# Altium schematic sheet PANUmbRev2.SchDoc
size C
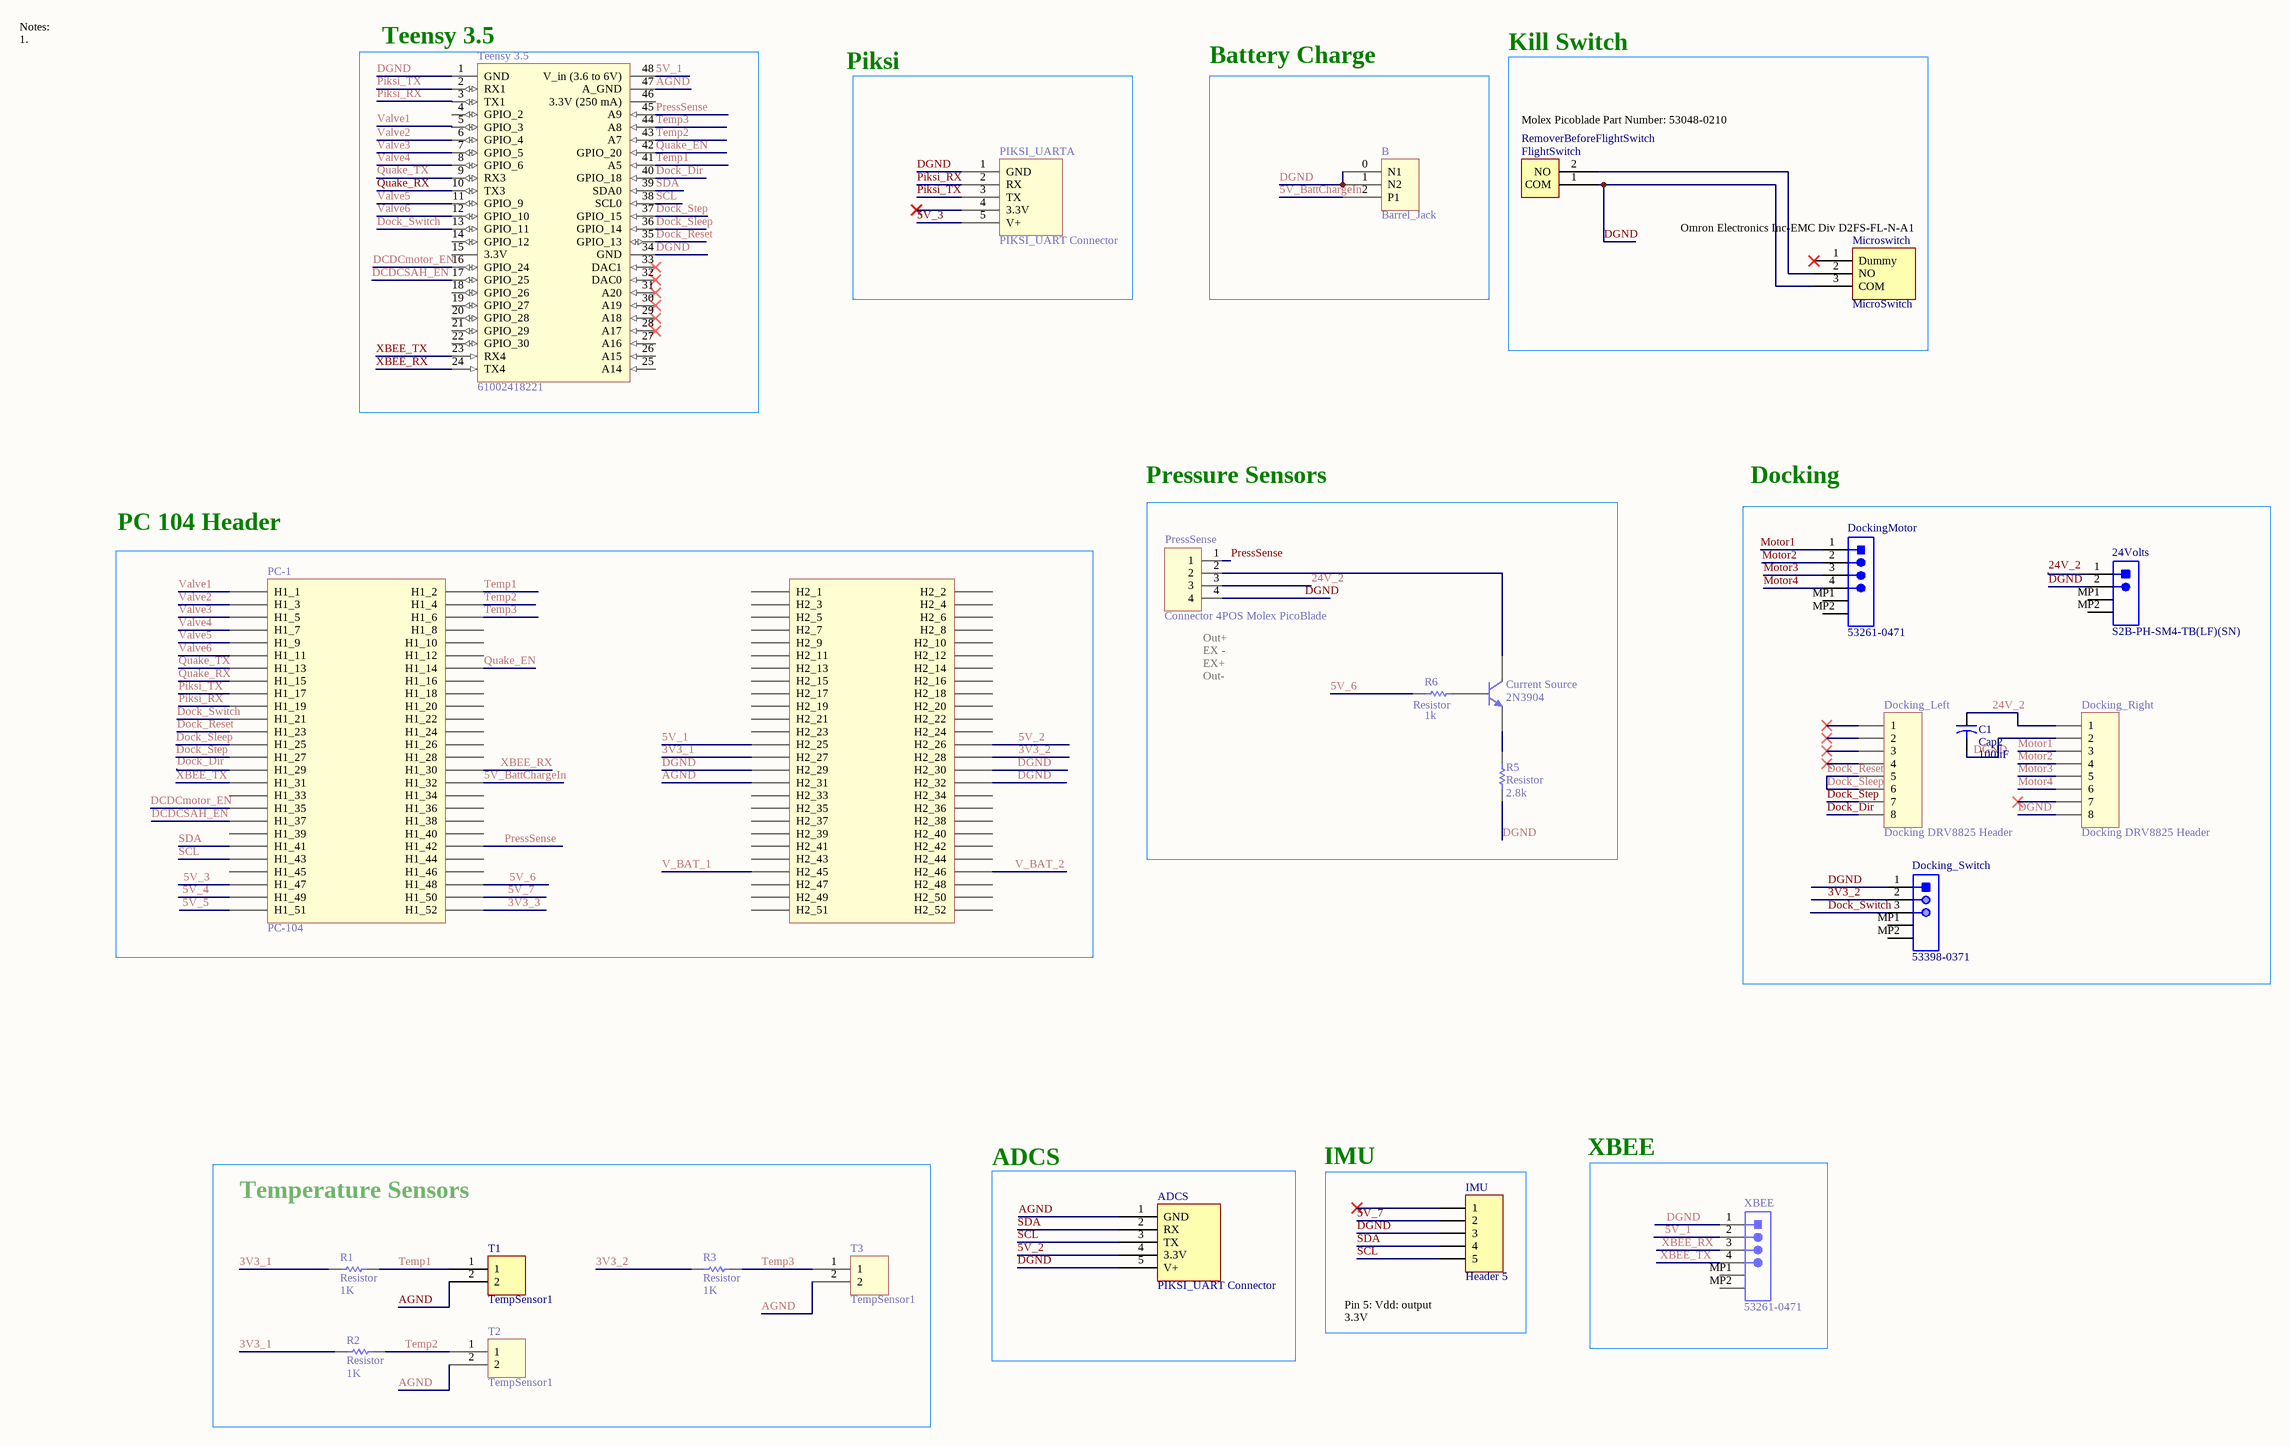
[diagram p0: PANUmbRev2.SchDoc]

## Parts
24Volts  S2B-PH-SM4-TB(LF)(SN)  [JST- S2B-PH-SM4-TB(LF)(SN)-2_V]
ADCS  PIKSI_UART Connector  [Molex Picoblade 5 Pin]
B  Barrel_Jack  [Barrel_Jack]
C1  Cap2  value 100uF  [CAPR5-4X5]
Current_Source  2N3904  [TO-92A]
Docking_Left  Docking DRV8825 Header  [HDR1X8]
Docking_Right  Docking DRV8825 Header  [HDR1X8]
Docking_Switch  53398-0371  [MOLX-53398-0371_V]
DockingMotor  53261-0471  [MOLEX-53261-0471_V]
FlightSwitch  RemoverBeforeFlightSwitch  [RemoverBeforeFlight Switch]
IMU  Header 5  [HDR1X5]
Microswitch  MicroSwitch  [MicroSwitch_3pin]
PC-1  PC-104  [PC-104FOOTPRINT]
PIKSI_UARTA  PIKSI_UART Connector  [Molex Picoblade 5 Pin]
PressSense  Connector 4POS Molex PicoBlade  [532610471]
R1  Resistor  value 1K  [AXIAL-0.3]
R2  Resistor  value 1K  [AXIAL-0.3]
R3  Resistor  value 1K  [AXIAL-0.3]
R5  Resistor  value 2.8k  [AXIAL-0.3]
R6  Resistor  value 1k  [AXIAL-0.3]
T1  TempSensor1  [RemoverBeforeFlight Switch]
T2  TempSensor1  [RemoverBeforeFlight Switch]
T3  TempSensor1  [RemoverBeforeFlight Switch]
Teensy_3.5  61002418221  [61002418221]
XBEE  53261-0471  [MOLEX-53261-0471_V]

## Blocks framed on the sheet
Teensy 3.5: Teensy_3.5
Kill Switch: FlightSwitch Microswitch
Battery Charge: B
Pressure Sensors: Current_Source PressSense R5 R6
Docking: 24Volts C1 Docking_Left Docking_Right Docking_Switch DockingMotor
PC 104 Header: PC-1
Temperature Sensors: R1-R3 T1-T3
ADCS: ADCS
IMU: IMU
XBEE: XBEE

## Nets
3V3_1: PC-1.H2_27 R1.1 R2.1
3V3_2: Docking_Switch.2 PC-1.H2_28 R3.1
3V3_3: PC-1.H1_52
5V_1: PC-1.H2_25 Teensy_3.5.48(V_in_(3.6_to_6V)) XBEE.2
5V_2: ADCS.4(3.3V) PC-1.H2_26
5V_3: PC-1.H1_47 PIKSI_UARTA.5(V+)
5V_4: PC-1.H1_49
5V_5: PC-1.H1_51
5V_6: PC-1.H1_48 R6.2
5V_7: IMU.2 PC-1.H1_50
5V_BattChargeIn: B.2(P1) PC-1.H1_32
24V_2: 24Volts.1 C1.1 Docking_Right.1 PressSense.3
AGND: ADCS.1(GND) PC-1.H2_31 T1.2 T2.2 T3.2 Teensy_3.5.47(A_GND)
DCDCmotor_EN: PC-1.H1_35 Teensy_3.5.16(GPIO_24)
DCDCSAH_EN: PC-1.H1_37 Teensy_3.5.17(GPIO_25)
DGND: 24Volts.2 ADCS.5(V+) B.0(N1) B.1(N2) C1.2 Docking_Right.2 Docking_Right.8 Docking_Switch.1 FlightSwitch.1(COM) IMU.3 Microswitch.3(COM) PC-1.H2_29 PC-1.H2_30 PC-1.H2_32 PIKSI_UARTA.1(GND) PressSense.4 R5.1 Teensy_3.5.1(GND) Teensy_3.5.34(GND) XBEE.1
Dock_Dir: Docking_Left.8 PC-1.H1_29 Teensy_3.5.40(GPIO_18)
Dock_Reset: Docking_Left.5 Docking_Left.6 PC-1.H1_23 PC-1.H1_25 Teensy_3.5.35(GPIO_13) Teensy_3.5.36(GPIO_14)  [also labelled Dock_Sleep]
Dock_Step: Docking_Left.7 PC-1.H1_27 Teensy_3.5.37(GPIO_15)
Dock_Switch: Docking_Switch.3 PC-1.H1_21 Teensy_3.5.13(GPIO_11)
Motor1: Docking_Right.3 DockingMotor.1
Motor2: Docking_Right.4 DockingMotor.2
Motor3: Docking_Right.5 DockingMotor.3
Motor4: Docking_Right.6 DockingMotor.4
Piksi_RX: PC-1.H1_19 PIKSI_UARTA.2(RX) Teensy_3.5.3(TX1)
Piksi_TX: PC-1.H1_17 PIKSI_UARTA.3(TX) Teensy_3.5.2(RX1)
PressSense: PC-1.H1_42 PressSense.1 Teensy_3.5.45(A9)
Quake_EN: PC-1.H1_14 Teensy_3.5.42(GPIO_20)
Quake_RX: PC-1.H1_15 Teensy_3.5.10(TX3)
Quake_TX: PC-1.H1_13 Teensy_3.5.9(RX3)
SCL: ADCS.3(TX) IMU.5 PC-1.H1_43 Teensy_3.5.38(SCL0)
SDA: ADCS.2(RX) IMU.4 PC-1.H1_41 Teensy_3.5.39(SDA0)
Temp1: PC-1.H1_2 R1.2 T1.1 Teensy_3.5.41(A5)
Temp2: PC-1.H1_4 R2.2 T2.1 Teensy_3.5.43(A7)
Temp3: PC-1.H1_6 R3.2 T3.1 Teensy_3.5.44(A8)
V_BAT_1: PC-1.H2_45
V_BAT_2: PC-1.H2_46
Valve1: PC-1.H1_1 Teensy_3.5.5(GPIO_3)
Valve2: PC-1.H1_3 Teensy_3.5.6(GPIO_4)
Valve3: PC-1.H1_5 Teensy_3.5.7(GPIO_5)
Valve4: PC-1.H1_7 Teensy_3.5.8(GPIO_6)
Valve5: PC-1.H1_9 Teensy_3.5.11(GPIO_9)
Valve6: PC-1.H1_11 Teensy_3.5.12(GPIO_10)
XBEE_RX: PC-1.H1_30 Teensy_3.5.24(TX4) XBEE.3
XBEE_TX: PC-1.H1_31 Teensy_3.5.23(RX4) XBEE.4
NetCurrent_Source_1: Current_Source.1(E) R5.2
NetCurrent_Source_2: Current_Source.2(B) R6.1
NetCurrent_Source_3: Current_Source.3(C) PressSense.2
NetFlightSwitch_2: FlightSwitch.2(NO) Microswitch.2(NO)

Not connected (* = marked no-connect by the designer): 24Volts MP1 MP2; Docking_Left 1* 2* 3* 4*; Docking_Right 7*; Docking_Switch MP1 MP2; DockingMotor MP1 MP2; IMU 1*; Microswitch 1(Dummy)*; PC-1 H1_8 H1_10 H1_12 H1_16 H1_18 H1_20 H1_22 H1_24 H1_26 H1_28 H1_33 H1_34 H1_36 H1_38 H1_39 H1_40 H1_44 H1_45 H1_46 H2_1 H2_2 H2_3 H2_4 H2_5 H2_6 H2_7 H2_8 H2_9 H2_10 H2_11 H2_12 H2_13 H2_14 H2_15 H2_16 H2_17 H2_18 H2_19 H2_20 H2_21 H2_22 H2_23 H2_24 H2_33 H2_34 H2_35 H2_36 H2_37 H2_38 H2_39 H2_40 H2_41 H2_42 H2_43 H2_44 H2_47 H2_48 H2_49 H2_50 H2_51 H2_52; PIKSI_UARTA 4(3.3V)*; Teensy_3.5 4(GPIO_2) 14(GPIO_12) 15(3.3V) 18(GPIO_26) 19(GPIO_27) 20(GPIO_28) 21(GPIO_29) 22(GPIO_30) 25(A14) 26(A15) 27(A16) 28(A17)* 29(A18)* 30(A19)* 31(A20)* 32(DAC0)* 33(DAC1)* 46(3.3V_(250_mA)); XBEE MP1 MP2

## Notes on the sheet
- Piksi
- Notes:
  1.
- (near FlightSwitch) Molex Picoblade Part Number: 53048-0210
- (near Microswitch) Omron Electronics Inc-EMC Div D2FS-FL-N-A1
- (near PressSense) Out+
  EX -
  EX+
  Out-
- (near IMU) Pin 5: Vdd: output 3.3V

## Library data of the parts
24Volts = CMP-1755-00001-1: Male Header, Pitch 2 mm, 1 x 2 Position, Height 5.5 mm, -25 to 85 degC, RoHS, Tape and Reel; Current Rating: 3 A; ComponentLink1URL: http://www.jst.com/home2.html; Radiation Hardening: No; RoHSCompliant: True; Mount: Through Hole; Contact Material: Bronze; Package Quantity: 100; Width: 2.34 mm; DatasheetVersion: Dec-12; Height: 8.13 mm; Max Operating Temperature: 105degC; ComponentLink2Description: Datasheet; Lead Pitch: 0.1 inch; Contact Finish: Lead; Packaging: Bulk; Colour: Black; Contact Plating: Tin; Min Operating Temperature: -65degC; ComponentLink1Description: Manufacturer URL; PackageReference: S2B-PH-SM4-TB(LF)(SN)-2; PackageDescription: Male Header, Pitch 2 mm, 1 x 2 Position, Height 5.5 mm; ComponentLink2URL: http://www.jst-mfg.com/product/pdf/eng/ePH.pdf; Pins: 40; Length: 101.19 mm
ADCS PIKSI_UARTA = PIKSI_UART Connector: Molex Picoblade 53261-0571
C1 = Cap2: Capacitor; Published: 23-Sep-2002; PackageReference: CAPR5-4X5; Publisher: Altium Limited; PackageDescription: Capacitor; 2 Leads
Current_Source = 2N3904: NPN General Purpose Amplifier; Published: 8-Jun-2000; LatestRevisionDate: 15-Jan-2003; LatestRevisionNote: PCB Footprint 'BCY-W3/D4.7' replaced; DatasheetVersion: 1997; PackageVersion: Sep-1998; PackageReference: TO-92A; Publisher: Altium Limited; PackageDescription: TO, Flat Index; 3 In-Line, Axial Leads; Body Dia. 4.5mm; Leads 0.51 x 0.48 mm (max); ComponentLink1Description: Manufacturer Link; ComponentLink1URL: http://www.fairchildsemi.com/; ComponentLink2Description: Datasheet; ComponentLink2URL: http://www.fairchildsemi.com/ds/2N%2F2N3904.pdf
Docking_Left Docking_Right = Header 8: Header, 8-Pin; LatestRevisionDate: 17-Jul-2002; LatestRevisionNote: Re-released for DXP Platform.; Publisher: Altium Limited
Docking_Switch = CMP-2000-05634-1: Male Header, Pitch 1.25 mm, 1 x 3 Position, Height 4.7 mm, -40 to 85 degC, RoHS, Tape and Reel; Voltage Rating: 125V; Brand: Molex; Pitch: 1.25mm; Mounting Angle: Vertical; Number of Positions: 3; Current Rating: 1A; Product Type: Headers; Tradename: PicoBlade; Package Reference: 53398-0371; Factory Pack Quantity: 1000; Product Category: Headers&WireHousings; Package Description: Male Header, Pitch 1.25 mm, 1 x 3 Position, Height 4.7 mm; Manufacturer: Molex; Packaging: Reel; Datasheet URL: http://www.molex.com/pdm_docs/sd/533980371_sd.pdf; Type: Shrouded; Manufacturer URL: http://www.molex.com/; Datasheet Version: Rev. J, 09/2015; Number of Positions / Contacts: 3; RoHS: Details; Contact Plating: Tin; Mounting Technology: SurfaceMount; Termination Style: SMD; Housing Material: Nylon; Number of Rows: 1; Mounting Style: SMD/SMT; Series: 53398; Contact Material: PhosphorBronze
DockingMotor XBEE = CMP-2000-05238-1: Male Header, Pitch 1.25 mm, 1 x 4 Position, Height 3.4 mm, -40 to 85 degC, RoHS, Tape and Reel; Current Rating: 1A; Brand: Molex; Number of Positions / Contacts: 4; Pitch: 1.25mm; Voltage Rating: 125V; Mounting Angle: Right; Manufacturer URL: http://www.molex.com/; Factory Pack Quantity: 1000; Housing Material: Thermoplastic; Datasheet URL: http://www.molex.com/pdm_docs/sd/532610471_sd.pdf; Tradename: PicoBlade; Product Type: Headers; Contact Plating: Tin; Contact Material: PhosphorBronze; Package Description: 1.25mm Pitch PicoBlade(TM) Header, Surface Mount, Right Angle, Lead-Free, 4 Circuits; Mounting Style: SMD/SMT; Manufacturer: Molex; Series: 53261; Packaging: Reel; Number of Rows: 1; RoHS: Details; Number of Positions: 4; Product Category: Headers&WireHousings; Datasheet Version: Rev. G, 01/2012; Type: Shrouded; Termination Style: SMD
FlightSwitch T1-T3 = RemoverBeforeFlightSwitch: 53048-0210 Molex Picoblade
IMU = Header 5: Header, 5-Pin; LatestRevisionDate: 17-Jul-2002; LatestRevisionNote: Re-released for DXP Platform.; Publisher: Altium Limited
Microswitch = MicroSwitch: Omron Electronics Inc-EMC Div D2FS-FL-N-A1
PC-1 = PC-104: ESQ-126-14-G-D (2 total needed)
PressSense = 532610471
R1-R3 R5 R6 = Res1: Published: 8-Jun-2000; LatestRevisionDate: 17-Jul-2002; LatestRevisionNote: Re-released for DXP Platform.; PackageReference: AXIAL-0.3; Publisher: Altium Limited; PackageDescription: Axial Device, Thru-Hole; 2 Leads; 0.3 in Pin Spacing
Teensy_3.5 = 61002418221: Wurth Elektronik WR-PHD Series, Series Number 6100, 2.54mm Pitch 24 Way 1 Row Right Angle PCB Header; Manufacturer_Name: WÃ¼rth Elektronik; Geometry.Height: mm; Supplier_Name: RS; RS Part Number: 1216841; Manufacturer_Part_Number: 61002418221; Allied_Number: *; Other Part Number: *; Datasheet Link: http://katalog.we-online.de/em/datasheet/6100xx18221.pdf; 3D Package: *